# Altium project EN2091_Analog_project.PrjPcb
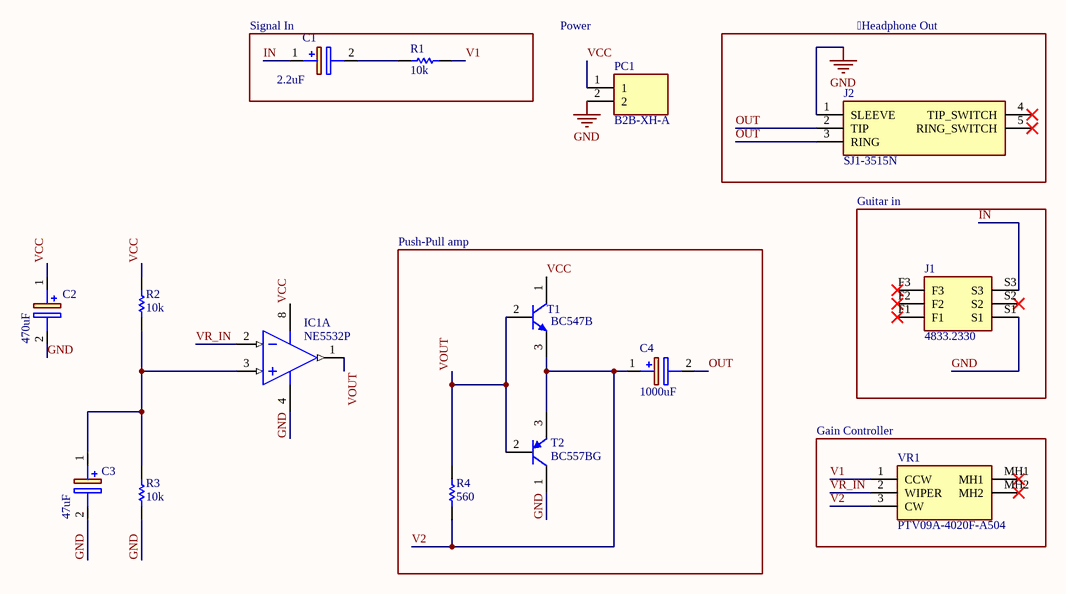
[diagram p0: Schemetic_2.SchDoc]
1 sheet, 15 parts. Net scope: global (net labels, ports and power ports of the same name join across sheets).
Board files: PCB_1.PcbDoc, PCB2.PcbDoc, PCB3.PcbDoc, PCB1.PcbDoc

## Sheet Schemetic_2.SchDoc
size A; SheetNumber: 1; SheetTotal: 1

### Parts
C1  2.2uF  [CAPPRD200W50D500H1250]
C2  470uF  [CAPPRD500W65D1000H1700]
C3  47uF  [CAPPRD500W60D1300H2200]
C4  1000uF  [CAPPRD750W85D1600H2200]
IC1  NE5532P  [P0008A]  (part A of 2)
J1  4833.2330  [48332330]
J2  SJ1-3515N  [SJ13515N]
PC1  B2B-XH-A  [SHDR2W64P0X250_1X2_740X575X700P]
R1  10k  [RESA60-630X240]
R2  10k  [RESA60-630X240]
R3  10k  [RESA60-630X240]
R4  560  [RESA60-630X240]
T1  BC547B  [ONSC-TO-92-3-29-11]
T2  BC557BG  [ONSC-TO-92-3-29-11]
VR1  PTV09A-4020F-A504  [PTV09A4020FA504]

### Blocks framed on the sheet
Signal In: C1 R1
Headphone Out: J2
Guitar in: J1
Push-Pull amp: C4 R4 T1 T2
Gain Controller: VR1

### Nets
GND: C2.2(-) C3.2(-) IC1.4(VCC-) J1.S1 J2.1(SLEEVE) PC1.2 R3.1 T2.1(C)
IN: C1.1(+) J1.S3
OUT: C4.2(-) J2.2(TIP) J2.3(RING)
V1: R1.2 VR1.1(CCW)
V2: C4.1(+) R4.1 T1.3(E) T2.3(E) VR1.3(CW)
VCC: C2.1(+) IC1.8(VCC+) PC1.1 R2.2 T1.1(C)
VOUT: IC1.1(OUT1) R4.2 T1.2(B) T2.2(B)
VR_IN: IC1.2(IN1-) VR1.2(WIPER)
NetC1_2: C1.2(-) R1.1
NetC3_1: C3.1(+) IC1.3(IN1+) R2.1 R3.2

Not connected (* = marked no-connect by the designer): J1 F1* F2* F3* S2*; J2 4(TIP_SWITCH)* 5(RING_SWITCH)*; VR1 MH1* MH2*

### Notes on the sheet
- Power

### Library data of the parts
C1 = ESK225M050AC3KA: Capacitor Polarised; Manufacturer_Name: KEMET; Datasheet Link: https://content.kemet.com/datasheets/KEM_A4004_ESK.pdf; Height: 12.5mm; Manufacturer_Part_Number: ESK225M050AC3KA; Mouser Part Number: 80-ESK225M050AC3KA; Mouser Price/Stock: https://www.mouser.com/Search/Refine.aspx?Keyword=80-ESK225M050AC3KA
C2 = ECA-1VM471B: Capacitor Polarised; Manufacturer_Name: Panasonic; Datasheet Link: http://industrial.panasonic.com/cdbs/www-data/pdf/RDF0000/ABA0000C1218.pdf; Height: 17mm; Manufacturer_Part_Number: ECA-1VM471B; Mouser Part Number: 667-ECA-1VM471B; Mouser Price/Stock: https://www.mouser.co.uk/ProductDetail/Panasonic/ECA-1VM471B?qs=HDhZcL5REiYtj3pihfsTHg%3D%3D; Arrow Part Number: ECA-1VM471B; Arrow Price/Stock: https://www.arrow.com/en/products/eca-1vm471b/panasonic?region=nac
C3 = UCS2E470MHD1TO: Capacitor Polarised; Manufacturer_Name: Nichicon; Datasheet Link: http://www.nichicon.co.jp/english/products/pdfs/e-ucs.pdf; Height: 22mm; Manufacturer_Part_Number: UCS2E470MHD1TO; Mouser Part Number: 647-UCS2E470MHD1TO; Mouser Price/Stock: https://www.mouser.com/Search/Refine.aspx?Keyword=647-UCS2E470MHD1TO; Arrow Part Number: UCS2E470MHD1TO; Arrow Price/Stock: https://www.arrow.com/en/products/ucs2e470mhd1to/nichicon
C4 = EEU-FC1V102S: Capacitor Polarised; Manufacturer_Name: Panasonic; Datasheet Link: http://industrial.panasonic.com/cdbs/www-data/pdf/RDF0000/ABA0000C1209.pdf; Height: 22mm; Manufacturer_Part_Number: EEU-FC1V102S; Mouser Part Number: 667-EEU-FC1V102S; Mouser Price/Stock: https://www.mouser.co.uk/ProductDetail/Panasonic/EEU-FC1V102S?qs=NFmy3EUjRuVoETF2mRqKyQ%3D%3D; Arrow Part Number: EEU-FC1V102S; Arrow Price/Stock: https://www.arrow.com/en/products/eeu-fc1v102s/panasonic?region=nac
IC1 = CMP-0017-00910-2: Dual Low-Noise High-Speed Audio Operational Amplifier, 10 to 30 V, 0 to 70 degC, 8-pin DIP (P8), Pb-Free (RoHS); Manufacturer: Texas Instruments; Iq per channel(Max)(mA): 4; Slew Rate(Typ)(V/us): 9; Vn at 1kHz(Typ)(nV/rtHz): 5; IIB(Max)(pA): 800000; Total Supply Voltage(Max)(+5V is 5, +/-5V is 10): 30; GBW(Typ)(MHz): 10; CMRR(Min)(dB): 70; Number of Channels: 2; Sub Family: General Purpose Amplifier, High Supply Voltage Amplifier (>=30V), Low Noise Amp (<=10nV/rtHz); ComponentLink2URL: http://www.ti.com/lit/ds/symlink/ne5532.pdf; PackageReference: P0008A; PackageDescription: 8-Pin Plastic In-Line, Body 9.59 x 6.35 mm, Pitch 2.54 mm; ComponentLink1Description: Manufacturer URL; Eco-Plan: Pb-Free (RoHS); Mounting Technology: Through Hole; Code_JEDEC: MS-001; PackageVersion: 4040082/E, 04/2010; DatasheetVersion: SLOS075I; ComponentLink3URL: http://www.ti.com/litv/pdf/mpdi001b; ComponentLink2Description: Datasheet; Vio (25C)(Max)(mV): 4; PartNumber: NE5532P; ComponentLink3Description: Package Specification; Total Supply Voltage(Min)(+5V is 5, +/-5V is 10): 10; ComponentLink1URL: http://www.ti.com/
J1 = 4833.2330: Connector; Manufacturer_Name: SCHURTER; Datasheet Link: https://4donline.ihs.com/images/VipMasterIC/IC/SHRI/SHRIS26499/SHRIS26511-1.pdf?hkey=52A5661711E402568146F3353EA87419; Height: 15.5mm; Manufacturer_Part_Number: 4833.2330; Mouser Part Number: 693-4833.233; Mouser Price/Stock: https://www.mouser.co.uk/ProductDetail/Schurter/4833.2330?qs=wwP%252BWDYHj0Z3fNxHdwSLYg%3D%3D
J2 = SJ1-3515N: Connector; Manufacturer_Name: CUI Devices; Datasheet Link: https://componentsearchengine.com/Datasheets/1/SJ1-3515N.pdf; Height: 6mm; Manufacturer_Part_Number: SJ1-3515N; Mouser Part Number: 490-SJ1-3515N; Mouser Price/Stock: https://www.mouser.co.uk/ProductDetail/CUI-Devices/SJ1-3515N?qs=WyjlAZoYn51jeVVXLxifpg%3D%3D; Arrow Part Number: SJ1-3515N; Arrow Price/Stock: https://www.arrow.com/en/products/sj1-3515n/cui-devices?region=nac
PC1 = B2B-XH-A: Connector; Manufacturer_Name: JST (JAPAN SOLDERLESS TERMINALS); Datasheet Link: https://order.jst-mfg.com/InternetShop/app/pdf_show.php?kbn=3&key=XH%20CONNECTOR%20THROUGH-HOLE%20TYPE%20SHROUDED%20HEADER.pdf; Height: 7mm; Manufacturer_Part_Number: B2B-XH-A
R1-R4 = CMP-1659-00074-2: Axial Resistor, 10 KOhm, +/- 1%, 0.25 W, -55 to 155 degC, 2-Pin THD, RoHS, Bulk; Manufacturer: Yageo; Temperature Coefficient: 100ppm\/degreesC; Voltage Rating: 250V; Voltage Rating (DC): 200V; Resistance: 10KOhm; Max Power Dissipation: 250mW; Datasheet URL: http://www.yageo.com/documents/recent/Yageo%20LR_MFR_2013.pdf; Packaging: Bulk; RoHSCompliant: True; Mount: ThroughHole; Package Reference: MFR-25; Termination: Axial; Composition: MetalFilm; Number of Terminations: 2; Package Quantity: 200; Mounting Technology: ThroughHole; Length: 0.248inch; Max Operating Temperature: 155degC; Min Operating Temperature: -55degC; Datasheet Version: 04/2013; Lead Free: LeadFree; Manufacturer URL: http://www.yageo.com/; Tolerance: 1%; Power Rating: 250mW; Package Description: 2-Pin Axial Lead, Dia 2.4 mm, Body Length 6.3 mm; Military Standard: Not; Case\/Package: Axial
T1 = CMP-1048-01467-1: Amplifier Transistor, NPN Silicon, 3-Pin TO-92, Bulk Box; Manufacturer: On Semiconductor; IC Continuous (A): 0.1; fT Min (MHz): 150; DatasheetVersion: Rev. 7; ComponentLink1URL: http://www.onsemi.com/; Polarity: NPN; RoHS: FALSE; ComponentLink1Description: Manufacturer URL; Packing: Bulk Box; PackageDescription: 3-Pin Transistor Outline, Body 4.825 x 3.685 mm, Pitch 1.27 mm; ComponentLink3URL: http://www.onsemi.cn/pub_link/Collateral/2N6426-D.PDF; ComponentLink2Description: Datasheet; PackageVersion: Rev. AM; PackageReference: TO-92-3-29-11_AM_SL; ComponentLink3Description: Package Specification; Mounting Technology: Through Hole; PartNumber: BC547B; ComponentLink2URL: http://www.onsemi.com/pub_link/Collateral/BC546-D.PDF
T2 = CMP-1048-01440-1: Amplifier Transistor, PNP Silicon, 3-Pin TO-92, Pb-Free, Bulk Box; Manufacturer: On Semiconductor; IC Continuous (A): -0.1; Polarity: PNP; RoHS: TRUE; ComponentLink1URL: http://www.onsemi.com/; ComponentLink3Description: Package Specification; PackageDescription: 3-Pin Transistor Outline, Body 4.825 x 3.685 mm, Pitch 1.27 mm; PackageReference: TO-92-3-29-11_AM_SL; ComponentLink2URL: http://www.onsemi.com/pub_link/Collateral/BC556B-D.PDF; ComponentLink2Description: Datasheet; ComponentLink1Description: Manufacturer URL; PackageVersion: Rev. AM; Mounting Technology: Through Hole; DatasheetVersion: Rev. 3; PartNumber: BC557BG; ComponentLink3URL: http://www.onsemi.cn/pub_link/Collateral/2N6426-D.PDF; Packing: Bulk Box
VR1 = PTV09A-4020F-A504: Variable Resistor; Manufacturer_Name: Bourns; Datasheet Link: https://datasheet.datasheetarchive.com/originals/distributors/SFDatasheet-7/sf-000140356.pdf; Height: 20mm; Manufacturer_Part_Number: PTV09A-4020F-A504; Mouser Part Number: 652-PTV09A-4020FA504; Mouser Price/Stock: https://www.mouser.co.uk/ProductDetail/Bourns/PTV09A-4020F-A504?qs=Qzws7J6gxqz8dpZEeJ%2FXBw%3D%3D; Arrow Part Number: PTV09A-4020F-A504; Arrow Price/Stock: https://www.arrow.com/en/products/ptv09a-4020f-a504/bourns?region=nac